# Altium schematic sheet IMX_3.3 V Analog Power Supply.SchDoc
size A4; SheetNumber: 5; SheetTotal: 8
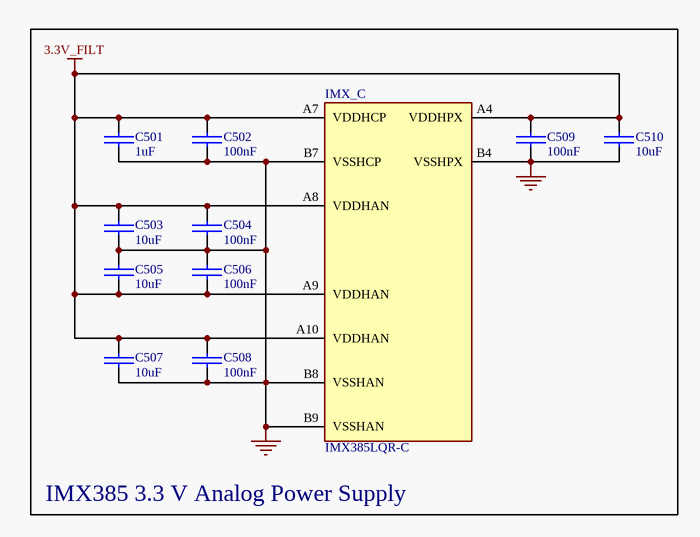
[diagram p0: IMX_3.3 V Analog Power Supply.SchDoc]

## Parts
C501  1uF  [Capacitor, 0402]
C502  100nF  [Capacitor, 0402]
C503  10uF  [Capacitor, 0603]
C504  100nF  [Capacitor, 0402]
C505  10uF  [Capacitor, 0603]
C506  100nF  [Capacitor, 0402]
C507  10uF  [Capacitor, 0603]
C508  100nF  [Capacitor, 0402]
C509  100nF  [Capacitor, 0402]
C510  10uF  [Capacitor, 0603]
IMX_  IMX385LQR-C  [IMX385LQR]  (part C of 6)

## Blocks framed on the sheet
IMX385 3.3 V Analog Power Supply: C501-C510 IMX_

## Nets
3.3V_FILT: C501.1 C502.1 C503.1 C504.1 C505.2 C506.2 C507.1 C508.1 C509.1 C510.1 IMX_.A4(VDDHPX) IMX_.A7(VDDHCP) IMX_.A8(VDDHAN) IMX_.A9(VDDHAN) IMX_.A10(VDDHAN)
GND: C501.2 C502.2 C503.2 C504.2 C505.1 C506.1 C507.2 C508.2 C509.2 C510.2 IMX_.B4(VSSHPX) IMX_.B7(VSSHCP) IMX_.B8(VSSHAN) IMX_.B9(VSSHAN)

## Library data of the parts
C501 = Capacitor, 0402, 1uF: Ceramic Capacitor, 10V, 10% +/- Tol, X7R, 1uF, SMD, 0402, #GRM155Z71A105KE01D, JLC#C528974; Capacitance: 1uF
C502 C504 C506 C508 C509 = Capacitor, 0402, 100nF: Ceramic Capacitor, 16V, 10% +/- Tol, X7R, 0.1uF, SMD, 0402, #CL05B104KO5NNNC, JLC#C1525; Capacitance: 100nF
C503 C505 C507 C510 = Capacitor, 0603, 10uF: Ceramic Capacitor, 10V, 10% +/- Tol, X7R, 10uF, SMD, 0603, #GRM188Z71A106KA73D, JLC#C2959727; Capacitance: 10uF
IMX_ = IMX385LQR